# Altium project mc_spine_con.PrjPcb
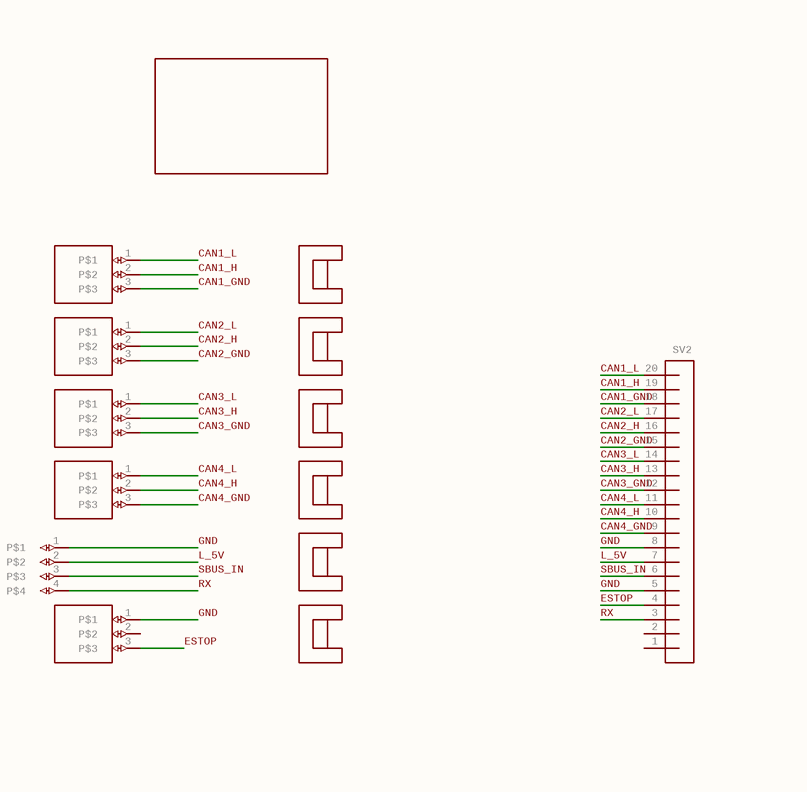
[diagram p0: mc_spine_con.SchDoc]
1 sheet, 14 parts. Net scope: global (net labels, ports and power ports of the same name join across sheets).
Board file: mc_spine_con.PcbDoc

## Sheet mc_spine_con.SchDoc
size 140 x 137 mm; Origin: Eagle

### Parts
SV2  MA20-1L  [MA20-1L]  (value not drawn)
U$1  3-PIN  [M80-8430342]  (value not drawn)
U$2  UP_BOARD_NOPINS  [UP_BOARD_NOPINS]  (value not drawn)
U$3  3-PIN  [M80-8430342]  (value not drawn)
U$4  3-PIN  [M80-8430342]  (value not drawn)
U$5  4-PIN  [M80-8430442]  (value not drawn)
U$6  3-PIN  [M80-8430342]  (value not drawn)
U$7  SMD_CABLE_CLIPSS8111-46R  [S8111-46R]  (value not drawn)
U$8  SMD_CABLE_CLIPSS8111-46R  [S8111-46R]  (value not drawn)
U$9  SMD_CABLE_CLIPSS8111-46R  [S8111-46R]  (value not drawn)
U$10  SMD_CABLE_CLIPSS8111-46R  [S8111-46R]  (value not drawn)
U$11  SMD_CABLE_CLIPSS8111-46R  [S8111-46R]  (value not drawn)
U$12  3-PIN  [M80-8430342]  (value not drawn)
U$13  SMD_CABLE_CLIPSS8111-46R  [S8111-46R]  (value not drawn)

### Nets
CAN1_GND: SV2.18 U$12.3(P$3)
CAN1_H: SV2.19 U$12.2(P$2)
CAN1_L: SV2.20 U$12.1(P$1)
CAN2_GND: SV2.15 U$1.3(P$3)
CAN2_H: SV2.16 U$1.2(P$2)
CAN2_L: SV2.17 U$1.1(P$1)
CAN3_GND: SV2.12 U$3.3(P$3)
CAN3_H: SV2.13 U$3.2(P$2)
CAN3_L: SV2.14 U$3.1(P$1)
CAN4_GND: SV2.9 U$4.3(P$3)
CAN4_H: SV2.10 U$4.2(P$2)
CAN4_L: SV2.11 U$4.1(P$1)
ESTOP: SV2.4 U$6.3(P$3)
GND: SV2.5 SV2.8 U$5.1(P$1) U$6.1(P$1)
L_5V: SV2.7 U$5.2(P$2)
RX: SV2.3 U$5.4(P$4)
SBUS_IN: SV2.6 U$5.3(P$3)

Not connected (* = marked no-connect by the designer): SV2 1 2; U$6 2(P$2)

### Library data of the parts
SV2 = MA20-1L: PIN HEADER; GateName_1: 1; SymbolName_1: MA20-1; LibraryName: con-lstb; DeviceSetName: MA20-1L; MF: MF; MPN: MPN; OC_FARNELL: unknown; OC_NEWARK: unknown
U$1 U$3 U$4 U$6 U$12 = 3-PIN: GateName_1: G$1; SymbolName_1: 3-PIN-CON; LibraryName: Ben_Library; DeviceSetName: 3-PIN
U$2 = UP_BOARD_NOPINS: GateName_1: G$1; SymbolName_1: UP_BOARD_NOPINS; LibraryName: Ben_Library; DeviceSetName: UP_BOARD_NOPINS
U$5 = 4-PIN: GateName_1: G$1; SymbolName_1: 4-PIN; LibraryName: Ben_Library; DeviceSetName: 4-PIN
U$7-U$11 U$13 = SMD_CABLE_CLIPSS8111-46R: GateName_1: G$1; SymbolName_1: CLIP; DeviceName: S8111-46R; LibraryName: Ben_Library; DeviceSetName: SMD_CABLE_CLIPS